# Altium project VoronCircuitBoard.PrjPcb
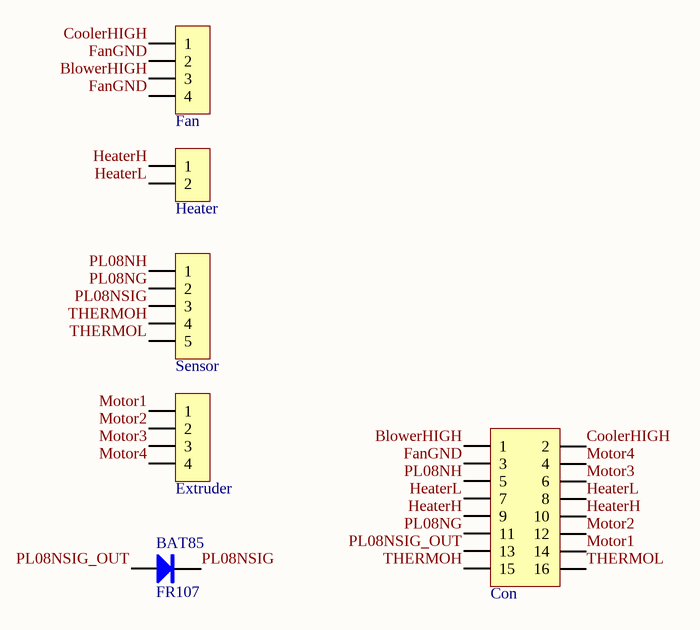
[diagram p0: Schematic.SchDoc]
1 sheet, 6 parts. Net scope: global (net labels, ports and power ports of the same name join across sheets).
Board file: Voron_Circuit_PCB.PcbDoc

## Sheet Schematic.SchDoc
size A4

### Parts
BAT85  FR107  [DO-41]
Con  Header 8X2  [IDC2.54-LI-2x8P]  (value not drawn)
Extruder  HDR-1X4  [XH2.54-LI-4P]  (value not drawn)
Fan  HDR-1X4  [XH2.54-LI-4P]  (value not drawn)
Heater  HDR-1X2  [KF128-5.08-2P]  (value not drawn)
Sensor  HDR-1X5  [XH2.54-LI-5P]  (value not drawn)

### Nets
BlowerHIGH: Con.1 Fan.3
CoolerHIGH: Con.2 Fan.1
FanGND: Con.3 Fan.2 Fan.4
HeaterH: Con.9 Con.10 Heater.1
HeaterL: Con.7 Con.8 Heater.2
Motor1: Con.14 Extruder.1
Motor2: Con.12 Extruder.2
Motor3: Con.6 Extruder.3
Motor4: Con.4 Extruder.4
PL08NG: Con.11 Sensor.2
PL08NH: Con.5 Sensor.1
PL08NSIG: BAT85.2(K) Sensor.3
PL08NSIG_OUT: BAT85.1(A) Con.13
THERMOH: Con.15 Sensor.4
THERMOL: Con.16 Sensor.5

### Library data of the parts
BAT85 = FR107: 快恢复整流二极管; BOM名称: 快恢复二极管; 版权归属: 封装库来自淘宝 ID：黄晶宝石; 属性: 700V/1A; 学习资源: https://shop463601444.taobao.com
Con = Header 8X2: 8*2P接插件; 版权归属: 封装库来自淘宝 ID：黄晶宝石; BOM名称: 8*2P接插件; 学习资源: https://shop463601444.taobao.com
Extruder Fan = Header 4: 4P接插件; 版权归属: 封装库来自淘宝 ID：黄晶宝石; BOM名称: 4P接插件; 学习资源: https://shop463601444.taobao.com
Heater = Header 2: 2P接插件; 版权归属: 封装库来自淘宝卖家 ID：黄晶宝石; BOM名称: 2P接插件; 学习资源: https://shop463601444.taobao.com
Sensor = Header 5: 5P接插件; 版权归属: 封装库来自淘宝 ID：黄晶宝石; BOM名称: 5P接插件; 学习资源: https://shop463601444.taobao.com